# Altium schematic sheet Digital Fanout.SchDoc
size A4
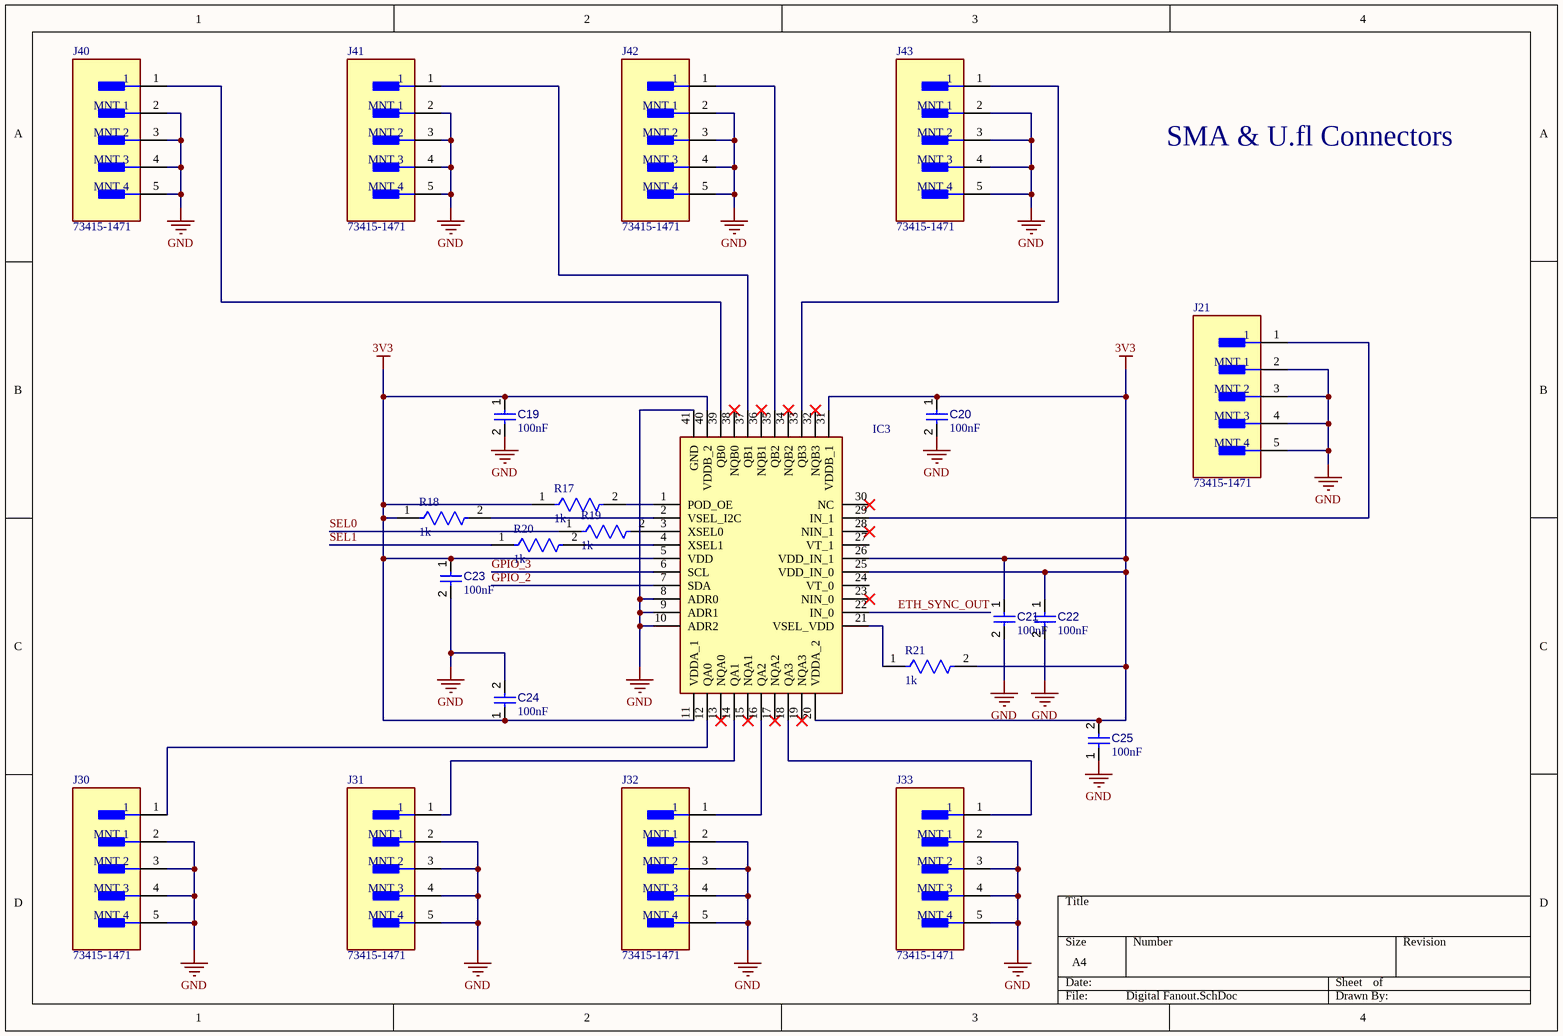
[diagram p0: Digital Fanout.SchDoc]

## Parts
C19  value 100nF  [CAPC0402(1005)60_L]  (hidden comment: Capacitor 100nF +/-20% 25V 0402)
C20  value 100nF  [CAPC0402(1005)60_L]  (hidden comment: Capacitor 100nF +/-20% 25V 0402)
C21  value 100nF  [CAPC0402(1005)60_L]  (hidden comment: Capacitor 100nF +/-20% 25V 0402)
C22  value 100nF  [CAPC0402(1005)60_L]  (hidden comment: Capacitor 100nF +/-20% 25V 0402)
C23  value 100nF  [CAPC0402(1005)60_L]  (hidden comment: Capacitor 100nF +/-20% 25V 0402)
C24  value 100nF  [CAPC0402(1005)60_L]  (hidden comment: Capacitor 100nF +/-20% 25V 0402)
C25  value 100nF  [CAPC0402(1005)60_L]  (hidden comment: Capacitor 100nF +/-20% 25V 0402)
IC3  8T79S308NLGI  [QFN50P600X600X100-41N]  (value not drawn)
J21  73415-1471  [FP-73415-1471-MFG]
J30  73415-1471  [FP-73415-1471-MFG]
J31  73415-1471  [FP-73415-1471-MFG]
J32  73415-1471  [FP-73415-1471-MFG]
J33  73415-1471  [FP-73415-1471-MFG]
J40  73415-1471  [FP-73415-1471-MFG]
J41  73415-1471  [FP-73415-1471-MFG]
J42  73415-1471  [FP-73415-1471-MFG]
J43  73415-1471  [FP-73415-1471-MFG]
R17  1k  [FP-CRCW0402-e3-MFG]
R18  1k  [FP-CRCW0402-e3-MFG]
R19  1k  [FP-CRCW0402-e3-MFG]
R20  1k  [FP-CRCW0402-e3-MFG]
R21  1k  [FP-CRCW0402-e3-MFG]

## Nets
3V3: C19.1 C20.1 C21.1 C22.1 C23.1 C24.1 C25.2 IC3.5(VDD) IC3.11(VDDA_1) IC3.20(VDDA_2) IC3.25(VDD_IN_0) IC3.26(VDD_IN_1) IC3.31(VDDB_1) IC3.40(VDDB_2) R17.1 R18.1 R21.2
GND: C19.2 C20.2 C21.2 C22.2 C23.2 C24.2 C25.1 IC3.8(ADR0) IC3.9(ADR1) IC3.10(ADR2) IC3.41(GND) J21.2(MNT_1) J21.3(MNT_2) J21.4(MNT_3) J21.5(MNT_4) J30.2(MNT_1) J30.3(MNT_2) J30.4(MNT_3) J30.5(MNT_4) J31.2(MNT_1) J31.3(MNT_2) J31.4(MNT_3) J31.5(MNT_4) J32.2(MNT_1) J32.3(MNT_2) J32.4(MNT_3) J32.5(MNT_4) J33.2(MNT_1) J33.3(MNT_2) J33.4(MNT_3) J33.5(MNT_4) J40.2(MNT_1) J40.3(MNT_2) J40.4(MNT_3) J40.5(MNT_4) J41.2(MNT_1) J41.3(MNT_2) J41.4(MNT_3) J41.5(MNT_4) J42.2(MNT_1) J42.3(MNT_2) J42.4(MNT_3) J42.5(MNT_4) J43.2(MNT_1) J43.3(MNT_2) J43.4(MNT_3) J43.5(MNT_4)
ETH_SYNC_OUT: IC3.22(IN_0)
GPIO_2: IC3.7(SDA)
GPIO_3: IC3.6(SCL)
SEL0: R19.1
SEL1: R20.1
NetIC3_1: IC3.1(POD_OE) R17.2
NetIC3_2: IC3.2(VSEL_I2C) R18.2
NetIC3_3: IC3.3(XSEL0) R19.2
NetIC3_4: IC3.4(XSEL1) R20.2
NetIC3_12: IC3.12(QA0) J30.1
NetIC3_14: IC3.14(QA1) J31.1
NetIC3_16: IC3.16(QA2) J32.1
NetIC3_18: IC3.18(QA3) J33.1
NetIC3_21: IC3.21(VSEL_VDD) R21.1
NetIC3_29: IC3.29(IN_1) J21.1
NetIC3_33: IC3.33(QB3) J43.1
NetIC3_35: IC3.35(QB2) J42.1
NetIC3_37: IC3.37(QB1) J41.1
NetIC3_39: IC3.39(QB0) J40.1

Not connected (* = marked no-connect by the designer): IC3 13(NQA0)* 15(NQA1)* 17(NQA2)* 19(NQA3)* 23(NIN_0)* 24(VT_0) 27(VT_1) 28(NIN_1)* 30(NC)* 32(NQB3)* 34(NQB2)* 36(NQB1)* 38(NQB0)*

## Notes on the sheet
- SMA & U.fl Connectors

## Library data of the parts
C19-C25 = CMP-001-00065-4: Chip Capacitor, 100nF +/-20%, 25V, 0402, Thickness 0.6 mm; Tolerance: 10%; Max Operating Temperature: 85°C; Min Operating Temperature: -55°C; Pins: 2; Voltage Rating: 25V; Mounting Technology: SMT; Case/Package: 0402
IC3 = 8T79S308NLGI: Integrated Circuit; Manufacturer_Name: Renesas Electronics; Datasheet Link: https://www.renesas.com/us/en/document/dst/8t79s308-datasheet; Height: 1mm; Manufacturer_Part_Number: 8T79S308NLGI; Mouser Part Number: 972-8T79S308NLGI; Mouser Price/Stock: https://www.mouser.co.uk/ProductDetail/Renesas-IDT/8T79S308NLGI?qs=%252BEew9%252B0nqrBGCQr1xG2Z%252Bw%3D%3D
J21 J30-J33 J40-J43 = CMP-04764-000011-1: CONN MMCX JACK STR 50 OHM PCB; Manufacturer: Molex; Conn Orientation: Straight; Pitch: 2.54mm; Impedance: 50Ω; Dielectric Material: TEFLON; Shielding: true; Voltage Rating: 170V; Number Of Contacts: 1; Frequency: 6GHz; Device Class L1: Connectors; Footprint Url: https://www.molex.com/pdm_docs/sd/734151471_sd.pdf; Height: 4.55mm; Lead Free: Yes; Automotive: No; Device Class L2: RF / Coaxial Connectors; Package: 73415-1471; Octopart: https://octopart.com/73415-1471-molex-776288; Digikey Description: CONN MMCX JACK STR 50 OHM PCB; Device Class L3: unset; ComponentLink2URL: https://www.molex.com/webdocs/datasheets/pdf/en-us/0734151471_RF_COAX_CONNECTORS.pdf; RoHS: TRUE; Category: Conn; Contact Material: Gold; Manufacturer Part Number: 73415-1471; ComponentLink2Description: Datasheet; Mouser Description: Conn.; RF/Coaxial; MMCX; Jack; Vertical; PCB; 50 Ohms; Rt. Angle; Gold Plate
R17-R21 = CMP-2002-08276-2: RES Thick Film, 1kΩ, 1%, 0.063W, 100ppm/°C, 0402; Resistance: 1kR; Power Rating: 63mW; Voltage Rating (DC): 50V; Package Quantity: 10; Termination: SMD/SMT; Width: 0.5mm; Military Standard: Not; Length: 1mm; Contact Plating: Tin; Mount: Surface Mount; Packaging: Tape and Reel; Case Code (Imperial): 0402; Tolerance: 1%; Weight: 2.3E-05oz; Number of Pins: 2; Case/Package: 0402; Case Code (Metric): 1005; Lead Free: Lead Free; Number of Terminations: 2; Max Power Dissipation: 63mW; Depth: 0.5mm; Temperature Coefficient: 100ppm/°C; Max Operating Temperature: 155°C; Height: 0.35mm; Features: Automotive AEC-Q200; Composition: Thick Film; Radiation Hardening: No; Voltage Rating: 50V; Min Operating Temperature: -55°C